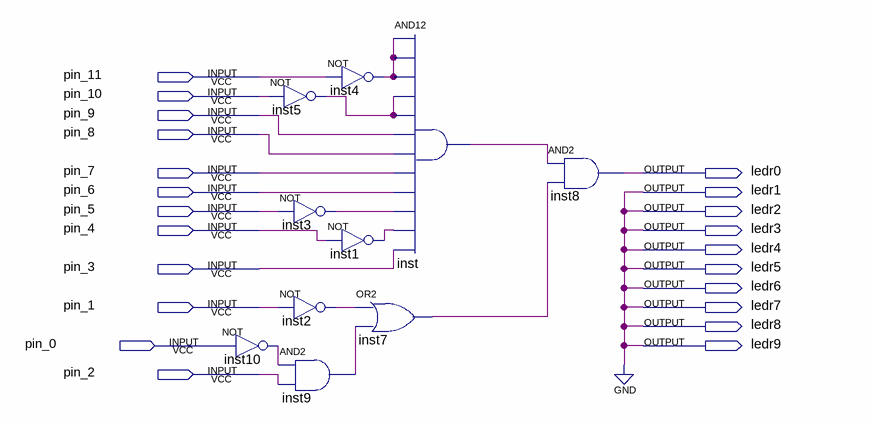
[diagram p0: schematic sheet]
// Quartus schematic lab3.bdf as structural Verilog: 10 symbols, 22 pins
module lab3 (
  input  pin_11,
  input  pin_10,
  input  pin_9,
  input  pin_8,
  input  pin_7,
  input  pin_6,
  input  pin_5,
  input  pin_4,
  input  pin_3,
  input  pin_1,
  input  pin_0,
  input  pin_2,
  output ledr0,
  output ledr1,
  output ledr2,
  output ledr3,
  output ledr4,
  output ledr5,
  output ledr6,
  output ledr7,
  output ledr8,
  output ledr9
);

  wire inst1_out, inst2_out, inst3_out, inst4_out, inst5_out, inst7_out, inst9_out, inst10_out, inst_out;

  not inst5 (inst5_out, pin_10);
  not inst3 (inst3_out, pin_5);
  not inst2 (inst2_out, pin_1);
  not inst10 (inst10_out, pin_0);
  and inst9 (inst9_out, inst10_out, pin_2);
  not inst4 (inst4_out, pin_11);
  not inst1 (inst1_out, pin_4);
  or inst7 (inst7_out, inst2_out, inst9_out);
  and inst (inst_out, inst4_out, inst4_out, inst4_out, inst5_out, inst5_out, pin_9, pin_8, pin_7, pin_6, inst3_out, inst1_out, pin_3);
  and inst8 (ledr0, inst_out, inst7_out);

  assign ledr1 = 1'b0;
  assign ledr2 = 1'b0;
  assign ledr3 = 1'b0;
  assign ledr4 = 1'b0;
  assign ledr5 = 1'b0;
  assign ledr6 = 1'b0;
  assign ledr7 = 1'b0;
  assign ledr8 = 1'b0;
  assign ledr9 = 1'b0;
endmodule
